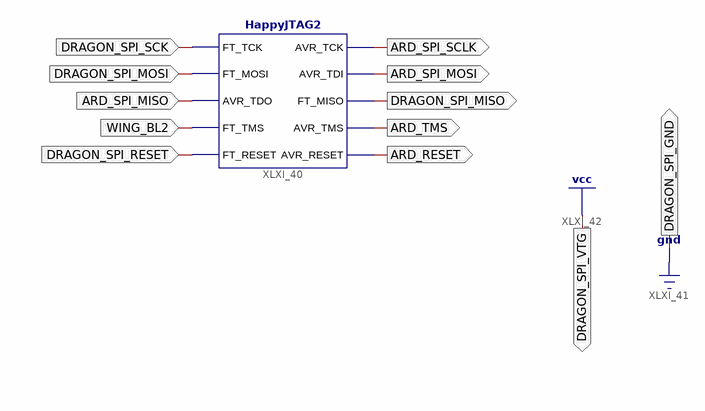
[diagram p0: schematic sheet 1]
// Xilinx ISE schematic Papilio_Pro.sch (spartan6) as structural Verilog: 1 symbols, 12 ports
module Papilio_Pro (
  input  DRAGON_SPI_SCK,
  input  DRAGON_SPI_MOSI,
  input  WING_BL2,
  input  DRAGON_SPI_RESET,
  input  ARD_SPI_MISO,
  output DRAGON_SPI_MISO,
  output ARD_SPI_SCLK,
  output ARD_TMS,
  output ARD_RESET,
  output ARD_SPI_MOSI,
  output DRAGON_SPI_VTG,
  output DRAGON_SPI_GND
);

  HappyJTAG2 XLXI_40 (
    .FT_TCK(DRAGON_SPI_SCK), .FT_MOSI(DRAGON_SPI_MOSI), .FT_MISO(DRAGON_SPI_MISO), .FT_TMS(WING_BL2),
    .FT_RESET(DRAGON_SPI_RESET), .AVR_TCK(ARD_SPI_SCLK), .AVR_TDI(ARD_SPI_MOSI), .AVR_TDO(ARD_SPI_MISO),
    .AVR_TMS(ARD_TMS), .AVR_RESET(ARD_RESET));

  assign DRAGON_SPI_GND = 1'b0;
  assign DRAGON_SPI_VTG = 1'b1;
endmodule
